# Altium schematic sheet projet_pcb_F103.SchDoc
size A3
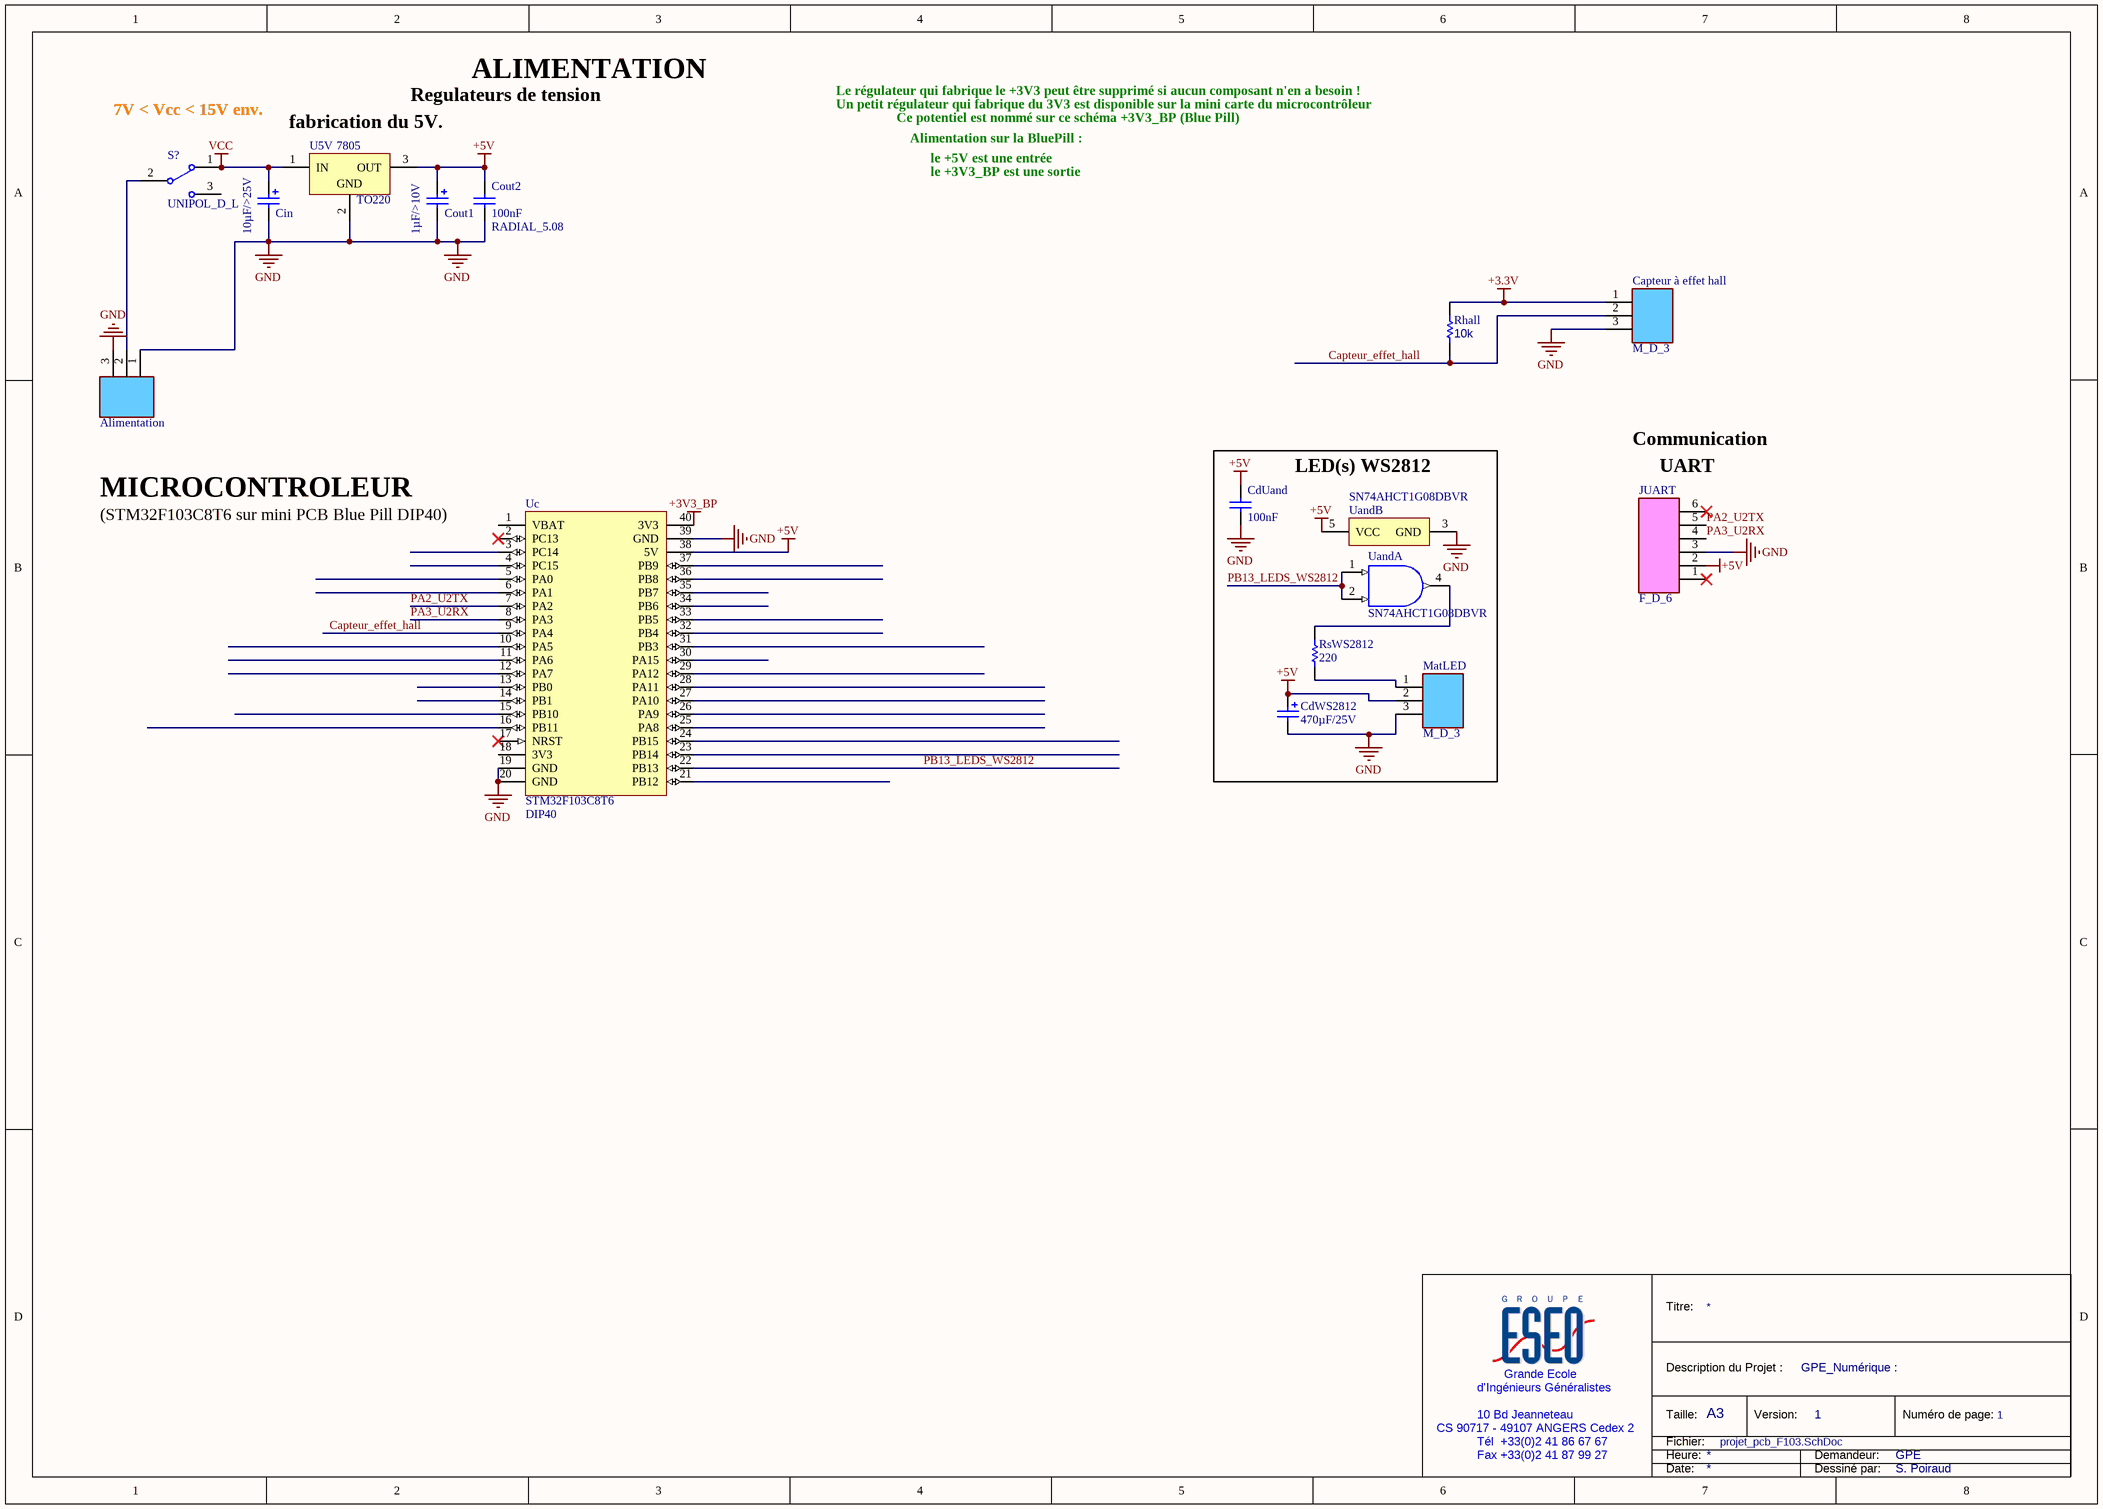
[diagram p0: projet_pcb_F103.SchDoc]

## Parts
?  BARRETTE 3 CONTACTS 1 RANGEE MALE DROITE  [BARRETTE_3_M_D]  (value not drawn)
Capteur_à_effet_hall  Type: M_D_3  [BARRETTE_3_M_D]  (hidden comment: BARRETTE 3 CONTACTS 1 RANGEE MALE DROITE)
CdUand  value 100nF  [CONDENSATEUR_CERAMIQUE_RADIAL_5.08]  (hidden comment: CONDENSATEUR_CER_RAD_5.08)
CdWS2812  value 470µF/25V  [CONDENSATEUR_POLARISE_ELECTROLYTIQUE_RADIAL_5.08/10.16]  (hidden comment: CONDENSATEUR_POL_ELECTROLY_RAD_5.08/10.16)
Cin  value 10µF/>25V  [CONDENSATEUR_POLARISE_ELECTROLYTIQUE_RADIAL_2.0/5.08]  (hidden comment: CONDENSATEUR_POL_ELECTROLY_RAD_2.0/5.08)
Cout1  value 1µF/>10V  [CONDENSATEUR_POLARISE_ELECTROLYTIQUE_RADIAL_2.0/5.08]  (hidden comment: CONDENSATEUR_POL_ELECTROLY_RAD_2.0/5.08)
Cout2  value 100nF  Type: RADIAL_5.08  [CONDENSATEUR_CERAMIQUE_RADIAL_5.08]  (hidden comment: CONDENSATEUR_CER_RAD_5.08)
JUART  Type: F_D_6  [BARRETTE_6_F_D]  (hidden comment: BARRETTE_6 CONTACTS_1 RANGEE_FEMELLE_DROITE)
MatLED  Type: M_D_3  [BARRETTE_3_M_D]  (hidden comment: BARRETTE 3 CONTACTS 1 RANGEE MALE DROITE)
Rhall  value 10k  [RESISTANCE_1/4W]  (hidden comment: RESISTANCE_AXIALE_1/4W)
RsWS2812  220  [RESISTANCE_1/4W]
S?  Type: UNIPOL_D_L  [INTER_UNIPOL_DROIT_LEVIER]  (hidden comment: INTERRUPTEUR_UNIPOLAIRE_DROIT_A_LEVIER)
U5V  Type: 7805  Package: TO220  [REGULATEUR_TO220_78XX]  (hidden comment: REGULATEUR_TO220_78XX)
Uand  SN74AHCT1G08DBVR  [DBV0005A_N]  (parts A,B of 2)
Uc  Type: STM32F103C8T6  Package: DIP40  [STM32F103C8T6_DIP40]  (hidden comment: STM32F103C8T6/PCB_DIP40)

## Blocks framed on the sheet
LED(s) WS2812: CdUand CdWS2812 MatLED RsWS2812 Uand

## Nets
+3.3V: Capteur_à_effet_hall.1 Rhall.2
+3V3_BP: Uc.40(3V3)
+5V: CdUand.2 CdWS2812.1 Cout1.1 Cout2.2 JUART.2 MatLED.2 U5V.3(OUT) Uand.5(VCC) Uc.38(5V)
GND: ?.1 ?.3 Capteur_à_effet_hall.3 CdUand.1 CdWS2812.2 Cin.2 Cout1.2 Cout2.1 JUART.3 MatLED.3 U5V.2(GND) Uand.3(GND) Uc.19(GND) Uc.20(GND) Uc.39(GND)
VCC: Cin.1 S?.1 U5V.1(IN)
Capteur_effet_hall: Capteur_à_effet_hall.2 Rhall.1 Uc.9(PA4)
PA2_U2TX: JUART.5 Uc.7(PA2)
PA3_U2RX: JUART.4 Uc.8(PA3)
PB13_LEDS_WS2812: Uand.1(A) Uand.2(B) Uc.22(PB13)
Net?_2: ?.2 S?.2
NetMatLED_1: MatLED.1 RsWS2812.1
NetRsWS2812_2: RsWS2812.2 Uand.4(Y)

Not connected (* = marked no-connect by the designer): JUART 1* 6*; S? 3; Uc 1(VBAT) 2(PC13)* 3(PC14) 4(PC15) 5(PA0) 6(PA1) 10(PA5) 11(PA6) 12(PA7) 13(PB0) 14(PB1) 15(PB10) 16(PB11) 17(NRST)* 18(3V3) 21(PB12) 23(PB14) 24(PB15) 25(PA8) 26(PA9) 27(PA10) 28(PA11) 29(PA12) 30(PA15) 31(PB3) 32(PB4) 33(PB5) 34(PB6) 35(PB7) 36(PB8) 37(PB9)

## Notes on the sheet
- Regulateurs de tension
- ALIMENTATION
- Le régulateur qui fabrique le +3V3 peut être supprimé si aucun composant n'en a besoin !
- Un petit régulateur qui fabrique du 3V3 est disponible sur la mini carte du microcontrôleur
- 7V < Vcc < 15V env.
- (near U5V) fabrication du 5V.
- Ce potentiel est nommé sur ce schéma +3V3_BP (Blue Pill)
- Alimentation sur la BluePill :
- le +3V3_BP est une sortie
- le +5V est une entrée
- Communication
- MICROCONTROLEUR
- (near JUART) UART
- (near Uc) (STM32F103C8T6 sur mini PCB Blue Pill DIP40)
- Titre:
- d'Ingénieurs Généralistes
- Grande Ecole
- Description du Projet :
- GPE_Numérique :
- CS 90717 - 49107 ANGERS Cedex 2
- 10 Bd Jeanneteau
- Tél  +33(0)2 41 86 67 67
- Fax +33(0)2 41 87 99 27
- Taille:
- Heure:
- Fichier:
- A3
- Version:
- 1
- Demandeur:
- GPE
- Numéro de page:
- Date:
- Dessiné par:
- S. Poiraud

## Library data of the parts
? Capteur_à_effet_hall MatLED = BARRETTE_3 CONTACTS_1 RANGEE_MALE_DROITE
  ?: Alimentation: Alimentation
CdUand Cout2 = CONDENSATEUR_CER_RAD_5.08: CONDENSATEUR TRAVERSANT CERAMIQUE RADIAL 5.08mm
  CdUand: Type: RADIAL_5.08
CdWS2812 = CONDENSATEUR_POL_ELECTROLY_RAD_5.08/10.16: CONDENSATEUR POLARISE ELECTROLYTIQUE RADIAL 5.08/10.16; Type: POL_RAD_5.08/10.16
Cin Cout1 = CONDENSATEUR_POL_ELECTROLY_RAD_2.0/5.08: CONDENSATEUR POLARISE ELECTROLYTIQUE RADIAL 2.0/5.08; Type: POL_RAD_2.0/5.08
JUART = BARRETTE_6 CONTACTS_1 RANGEE_FEMELLE_DROITE: BARRETTE 6 CONTACTS 1 RANGEE FEMELLE DROITE
Rhall = RESISTANCE_AXIALE_1/4W: RESISTANCE TRAVERSANTE AXIALE 1/4W; Type: 1/4W
RsWS2812 = Resistor: Published: 8-Jun-2000; LatestRevisionDate: 17-Jul-2002; LatestRevisionNote: Re-released for DXP Platform.; PackageReference: AXIAL-0.5; Publisher: Altium Limited
U5V = REGULATEUR_TO220_78XX: REGULATEUR DE TENSION POSITIVE 78XX BOITIER TO220
Uand = SN74AHCT1G08DBVR: Single 2-Input Positive-AND Gate, DBV0005A, LARGE T&R; Manufacturer: Texas Instruments; VCC(Min)(V): 2; VCC(Max)(V): 5.5; Output Type: CMOS; ICC @ Nom Voltage(Max)(mA): 0.01; Bits(#): 1; F @ Nom Voltage(Max)(Mhz): 75; Rating: Catalog; Technology Family: AHCT; Voltage(Nom)(V): 5; Schmitt Trigger: No; Output Drive (IOL/IOH)(Max)(mA): 8/-8; tpd @ Nom Voltage(Max)(ns): 7.1; Logic: True; Gate Type: AND; DatasheetVersion: SCLS315P; PackageReference: DBV0005A; Supplier 1: Mouser; Supplier Part Number 1: 595-SN74AHCT1G08DBVR; Supplier 2: Digi-Key; Supplier Part Number 2: 296-1113-2-ND; Supplier 3: Digi-Key; Supplier Part Number 3: 296-1113-1-ND; Supplier 4: Digi-Key; Supplier Part Number 4: 296-1113-6-ND; Generic Part Number: SN74AHCT1G08; Input Type: CMOS; Operating Temperature Range(C): -40 to 125; Sub-Family: AND Gate; 3-State Output: No; PartNumber: SN74AHCT1G08DBVR; ComponentLink1Description: Manufacturer URL; ComponentLink1URL: http://www.ti.com/; ComponentLink2Description: Datasheet; ComponentLink2URL: http://www.ti.com/lit/ds/symlink/sn74ahct1g08.pdf
Uc = STM32F103C8T6/PCB_DIP40: MICROCONTROLEUR 32 BITS - 72MHz - 34 I/O - 64 KO : FLASH - 20KO RAM - 10 CANAUX A/D 12 BITS - DIP40 - UART, SPI, I2C, USB, CAN